# EAGLE design rogger (EAGLE 7.2.0)
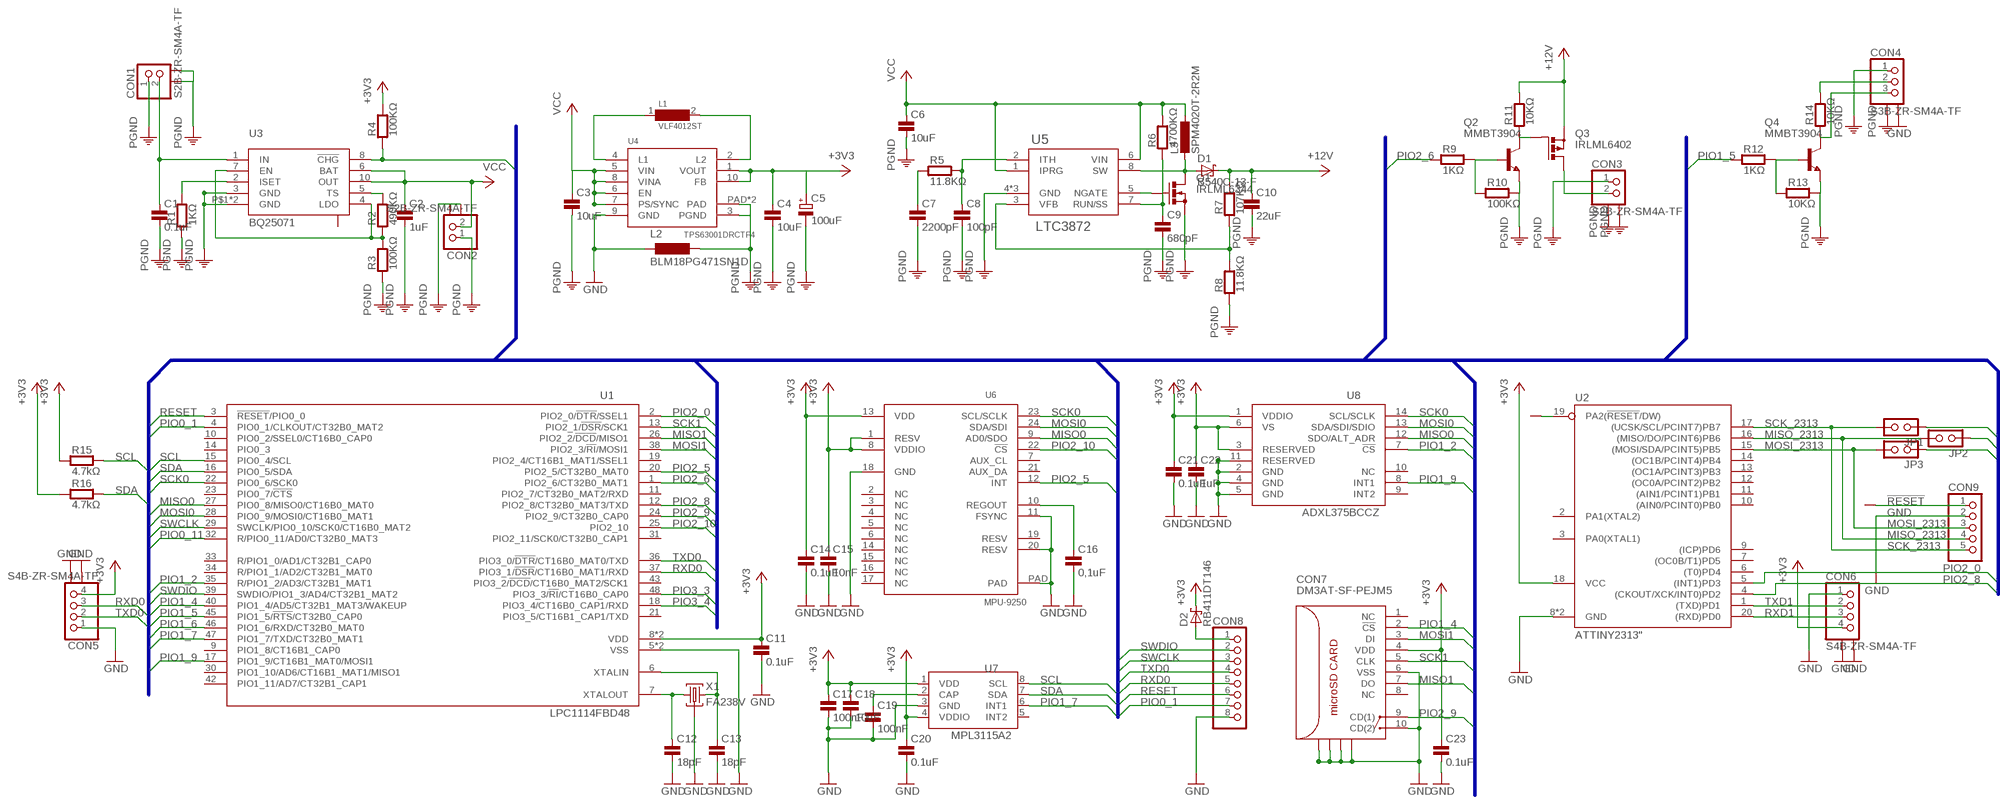
[diagram p0: schematic, sheet 1, part 1 of 2]
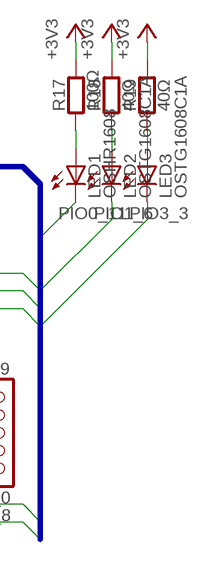
[diagram p1: schematic, sheet 1, part 2 of 2]

## Parts
C1  0.1uF  C0603  [0603]
C2  1uF  C0603  [0603]
C3  10uF  C0603  [0603]
C4  10uF  C0603  [0603]
C5  100uF  CPOL-EU153CLV-0505  [153CLV-0505]
C6  10uF  C0603  [0603]
C7  2200pF  C0603  [0603]
C8  100pF  C0603  [0603]
C9  680pF  C0603  [0603]
C10  22uF  C0805  [0805]
C11  0.1uF  C0603  [0603]
C12  18pF  C0603  [0603]
C13  18pF  C0603  [0603]
C14  0.1uF  C0603  [0603]
C15  10nF  C0603  [0603]
C16  0,1uF  C0603  [0603]
C17  100nF  C0603  [0603]
C18  10uF  C0603  [0603]
C19  100nF  C0603  [0603]
C20  0.1uF  C0603  [0603]
C21  0.1uF  C0603  [0603]
C22  1uF  C0603  [0603]
C23  0.1uF  C0603  [0603]
CON1  S2B-ZR-SM4A-TF  [S2B-ZR-SM4A-TF]
CON2  S2B-ZR-SM4A-TF  [S2B-ZR-SM4A-TF]
CON3  S2B-ZR-SM4A-TF  [S2B-ZR-SM4A-TF]
CON4  S3B-ZR-SM4A-TF  [S3B-ZR-SM4A-TF]
CON5  S4B-ZR-SM4A-TF  [S4B-ZR-SM4A-TF]
CON6  S4B-ZR-SM4A-TF  [S4B-ZR-SM4A-TF]
CON7  DM3AT-SF-PEJM5  [DM3AT-SF-PEJM5]
CON8  PINHEAD1X8  [1X8]
CON9  PINHEAD1X5  [1X5]
D1  B540C-13-F  B540C  [SMC]
D2  RB411DT146  BAS40  [SOT23]
JP1  JUMP-2  [JUMP-2]
JP2  JUMP-2  [JUMP-2]
JP3  JUMP-2  [JUMP-2]
L1  VLF4012ST  [VLF4012ST]
L2  BLM18PG471SN1D  L  [0603]
L3  SPM4020T-2R2M  [SPM4020T-2R2M]
LED1  OSHR1608  LEDCHIP-LED0603  [CHIP-LED0603]
LED2  OSTG1608C1A  LEDCHIP-LED0603  [CHIP-LED0603]
LED3  OSTG1608C1A  LEDCHIP-LED0603  [CHIP-LED0603]
Q1  IRLML6344  NMOS  [SOT23]
Q2  MMBT3904  NPN  [SOT23]
Q3  IRLML6402  PMOSSOT23  [SOT23]
Q4  MMBT3904  NPN  [SOT23]
R1  1KΩ  R0603  [0603]
R2  490KΩ  R0603  [0603]
R3  100KΩ  R0603  [0603]
R4  100KΩ  R0603  [0603]
R5  11.8KΩ  R0603  [0603]
R6  4700KΩ  R0603  [0603]
R7  107KΩ  R0603  [0603]
R8  11.8KΩ  R0603  [0603]
R9  1KΩ  R0603  [0603]
R10  100KΩ  R0603  [0603]
R11  10KΩ  R0603  [0603]
R12  1KΩ  R0603  [0603]
R13  10KΩ  R0603  [0603]
R14  10KΩ  R0603  [0603]
R15  4.7kΩ  R0603  [0603]
R16  4.7kΩ  R0603  [0603]
R17  100Ω  R0603  [0603]
R18  40Ω  R0603  [0603]
R19  40Ω  R0603  [0603]
U1  LPC1114FBD48  [LQFP48]
U2  ATTINY2313"  [MLF20]
U3  BQ25071  [W-PWSON-N10]
U4  TPS63001DRCTF4  [S-PVSON-N10]
U5  LTC3872  [TSOT-23-8]
U6  MPU-9250  [24QFN]
U7  MPL3115A2  [MPL3115A2]
U8  ADXL375BCCZ  [LGA-14]
X1  FA238V  [V66RA]

## Nets
!RESET!: CON9.1 U2.19(PA2(!RESET!/DW)) ; supply symbol labelled CONNECT
+3V3: C4.1 C5.+ C11.1 C14.1 C15.1 C17.1 C18.1 C20.1 C21.1 C22.1 C23.1 CON5.4 CON6.4 CON7.4(VDD) D2.3(C) R4.2 R15.1 R16.1 R17.2 R18.2 R19.2 U1.8(VDD) U1.44(VDD) U2.18(VCC) U4.1(VOUT) U4.10(FB) U6.1(RESV) U6.8(VDDIO) U6.13(VDD) U7.1(VDD) U7.4(VDDIO) U8.1(VDDIO) U8.3(RESERVED) U8.6(VS)
+5V: CON4.2 R14.2
+12V: C10.1 D1.C Q3.2(S) R7.2 R11.2
GND: C11.2 C12.2 C13.2 C14.2 C15.2 C16.2 C17.2 C18.2 C19.2 C20.2 C21.2 C22.2 C23.2 CON4.PAD2 CON5.1 CON5.PAD1 CON5.PAD2 CON6.1 CON6.PAD1 CON6.PAD2 CON7.6(VSS) CON7.10(CD(2)) CON7.P$10 CON7.P$11 CON7.P$12 CON7.P$14 CON8.8 CON9.2 L2.1 U1.5(VSS) U1.41(VSS) U2.8(GND) U2.P$1(GND) U4.9(GND) U6.11(FSYNC) U6.18(GND) U6.20(RESV) U6.PAD U7.3(GND) U8.2(GND) U8.4(GND) U8.5(GND) U8.11(RESERVED) X1.P2GND(GND) X1.P4GND(GND)
MISO0: JP2.2 U1.27(PIO0_8/MISO0/CT16B0_MAT0) U6.9(AD0/SDO) U8.12(SDO/ALT_ADR)
MISO1: CON7.7(DO) U1.26(PIO2_2/!DCD!/MISO1)
MISO_2313: CON9.4 JP2.1 U2.16((MISO/DO/PCINT6)PB6)
MOSI0: JP3.2 U1.28(PIO0_9/MOSI0/CT16B0_MAT1) U6.24(SDA/SDI) U8.13(SDA/SDI/SDIO)
MOSI1: CON7.3(DI) U1.38(PIO2_3/!RI!/MOSI1)
MOSI_2313: CON9.3 JP3.1 U2.15((MOSI/SDA/PCINT5)PB5)
N$1: C12.1 U1.7(XTALOUT) X1.P1X1(X1)
N$2: C13.1 U1.6(XTALIN) X1.P3X2(X2)
N$3: CON8.1 D2.1(A)
N$4: L1.1 U4.4(L1)
N$5: L1.2 U4.2(L2)
N$6: C19.1 U7.2(CAP)
N$7: Q1.1(G) U5.5(NGATE)
N$8: D1.A L3.P$2 Q1.3(D) U5.8(SW)
N$9: C16.1 U6.10(REGOUT)
N$11: C9.1 R6.1 U5.7(RUN/SS)
N$12: R1.2 U3.2(ISET)
N$13: R7.1 R8.2 U5.3(VFB)
N$14: R2.2 U3.5(TS)
N$15: R2.1 R3.2 U3.4(LDO) U3.7(EN)
N$16: C8.1 R5.2 U5.2(ITH)
N$17: CON3.2 Q3.3(D)
N$18: C7.1 R5.1
N$19: Q2.3(C) Q3.1(G) R11.1
N$21: CON4.3 Q4.3(C) R14.1
N$22: Q2.1(B) R9.2 R10.1
N$24: Q4.1(B) R12.2 R13.1
N$26: LED1.A R17.1
N$29: C1.1 CON1.2 U3.1(IN)
N$36: LED2.A R18.1
N$37: LED3.A R19.1
PE: C1.2 C2.2 C3.2 C4.2 C5.- C6.2 C7.2 C8.2 C9.2 C10.2 CON1.1 CON1.PAD1 CON1.PAD2 CON2.1 CON2.PAD1 CON2.PAD2 CON3.1 CON3.PAD1 CON3.PAD2 CON4.1 CON4.PAD1 L2.2 Q1.2(S) Q2.2(E) Q4.2(E) R1.1 R3.1 R8.1 R10.2 R13.2 U3.3(GND) U3.P$1(GND) U3.PAD(GND) U4.3(PGND) U4.PAD U4.PAD@1(PAD) U5.4(GND) U5.P$1(GND) U5.P$2(GND) ; supply symbol labelled PGND
PIO0_1: CON8.7 U1.4(PIO0_1/CLKOUT/CT32B0_MAT2)
PIO0_11: LED1.C U1.32(R/PIO0_11/AD0/CT32B0_MAT3)
PIO1_2: U1.35(R/PIO1_2/AD3/CT32B1_MAT1) U8.7(!CS!)
PIO1_4: CON7.2(!CS!) U1.40(PIO1_4/AD5/CT32B1_MAT3/WAKEUP)
PIO1_5: R12.1 U1.45(PIO1_5/!RTS!/CT32B0_CAP0)
PIO1_6: LED2.C U1.46(PIO1_6/RXD/CT32B0_MAT0)
PIO1_7: U1.47(PIO1_7/TXD/CT32B0_MAT1) U7.6(INT1)
PIO1_9: U1.17(PIO1_9/CT16B1_MAT0/MOSI1) U8.8(INT1)
PIO2_0: U1.2(PIO2_0/!DTR!/SSEL1) U2.5((INT1)PD3)
PIO2_5: U1.20(PIO2_5/CT32B0_MAT0) U6.12(INT)
PIO2_6: R9.1 U1.1(PIO2_6/CT32B0_MAT1)
PIO2_8: U1.12(PIO2_8/CT32B0_MAT3/TXD) U2.4((CKOUT/XCK/INT0)PD2)
PIO2_9: CON7.9(CD(1)) U1.24(PIO2_9/CT32B0_CAP0)
PIO2_10: U1.25(PIO2_10) U6.22(!CS!)
PIO3_3: LED3.C U1.48(PIO3_3/!RI!/CT16B0_CAP0)
PIO3_4: R4.1 U1.18(PIO3_4/CT16B0_CAP1/RXD) U3.8(!CHG!)
RESET: CON8.6 U1.3(!RESET!/PIO0_0)
RXD0: CON5.3 CON8.5 U1.37(PIO3_1/!DSR!/CT16B0_MAT1/RXD)
RXD1: CON6.3 U2.20((RXD)PD0)
SCK0: JP1.2 U1.22(PIO0_6/SCK0) U6.23(SCL/SCLK) U8.14(SCL/SCLK)
SCK1: CON7.5(CLK) U1.13(PIO2_1/!DSR!/SCK1)
SCK_2313: CON9.5 JP1.1 U2.17((UCSK/SCL/PCINT7)PB7)
SCL: R15.2 U1.15(PIO0_4/SCL) U7.8(SCL)
SDA: R16.2 U1.16(PIO0_5/SDA) U7.7(SDA)
SWCLK: CON8.3 U1.29(SWCLK/PIO0_10/SCK0/CT16B0_MAT2)
SWDIO: CON8.2 U1.39(SWDIO/PIO1_3/AD4/CT32B1_MAT2)
TXD0: CON5.2 CON8.4 U1.36(PIO3_0/!DTR!/CT16B0_MAT0/TXD)
TXD1: CON6.2 U2.1((TXD)PD1)
VCC: C2.1 C3.1 C6.1 CON2.2 L3.P$1 R6.2 U3.6(BAT) U3.10(OUT) U4.5(VIN) U4.6(EN) U4.7(PS/SYNC) U4.8(VINA) U5.1(IPRG) U5.6(VIN)
Unconnected: CON7.1(NC) CON7.8(NC) U1.9(PIO1_8/CT16B1_CAP0) U1.10(PIO0_2/SSEL0/CT16B0_CAP0) U1.11(PIO2_7/CT32B0_MAT2/RXD) U1.14(PIO0_3) U1.19(PIO2_4/CT16B1_MAT1/SSEL1) U1.21(PIO3_5/CT16B1_CAP1/TXD) U1.23(PIO0_7/!CTS!) U1.30(PIO1_10/AD6/CT16B1_MAT1/MISO1) U1.31(PIO2_11/SCK0/CT32B0_CAP1) U1.33(R/PIO1_0/AD1/CT32B1_CAP0) U1.34(R/PIO1_1/AD2/CT32B1_MAT0) U1.42(PIO1_11/AD7/CT32B1_CAP1) U1.43(PIO3_2/!DCD!/CT16B0_MAT2/SCK1) U2.2(PA1(XTAL2)) U2.3(PA0(XTAL1)) U2.6((T0)PD4) U2.7((OC0B/T1)PD5) U2.9((ICP)PD6) U2.10((AIN0/PCINT0)PB0) U2.11((AIN1/PCINT1)PB1) U2.12((OC0A/PCINT2)PB2) U2.13((OC1A/PCINT3)PB3) U2.14((OC1B/PCINT4)PB4) U6.2(NC) U6.3(NC) U6.4(NC) U6.5(NC) U6.6(NC) U6.7(AUX_CL) U6.14(NC) U6.15(NC) U6.16(NC) U6.17(NC) U6.19(RESV) U6.21(AUX_DA) U7.5(INT2) U8.9(INT2) U8.10(NC)

## Buses
PIO0_[0..11],PIO1_[0..11],PIO2_[0..11],PIO3_[0..5],SCL,SDA,SCK[0..1],MISO[0..1],MOSI[0..1],RESET,SWCLK,SWDIO,TXD0,RXD0

## Power pins joined to a net without a drawn wire
PAD: U3.9(PAD)

## Library data of the parts
C1-C4 C6-C23 = 201508-noshiro:C
C5 = rcl:CPOL-EU: POLARIZED CAPACITOR, European symbol
CON1-CON3 = 201508-noshiro:S2B-ZR-SM4A-TF
CON4 = 201508-noshiro:S3B-ZR-SM4A-TF
CON5 CON6 = 201508-noshiro:S4B-ZR-SM4A-TF
CON7 = 201508-noshiro:DM3AT-SF-PEJM5
CON8 = 201508-noshiro:PINHEAD1X8: PIN HEADER
CON9 = 201508-noshiro:PINHEAD1X5: PIN HEADER
D1 = 201508-noshiro:B540C
D2 = 201508-noshiro:BAS40: Silicon Schottky Diodes General-purpose diode for high-speed switching
JP1-JP3 = 201508-noshiro:JUMP-2
L1 = 201508-noshiro:VLF4012ST
L2 = 201508-noshiro:L
L3 = 201508-noshiro:SPM4020T-2R2M
LED1-LED3 = led:LED: LED OSRAM: - CHIPLED LG R971, LG N971, LY N971, LG Q971, LY Q971, LO R971, LY R971 LH N974, LH R974 LS Q976, LO Q976, LY Q976 LO Q996 - Hyper CHIPLED LW Q18S LB Q993, LB Q99A, LB R99A - SideLED LS A670, LO A670, LY A670, LG A670, LP A670 LB A673, LV A673, LT A673, LW A673 LH A674 LY A675 LS A676, LA A676, LO A676, LY A676, LW A676 LS A679, LY A679, LG A679 - Hyper Micro SIDELED® LS Y876, LA Y876, LO Y876, LY Y876 LT Y87S - SmartLED LW L88C, LW L88S LB L89C, LB L89S, LG L890 LS L89K, LO L89K, LY L89K LS L896, LA L896, LO L896, LY L896 - TOPLED LS T670, LO T670, LY T670, LG T670, LP T670 LSG T670, LSP T670, LSY T670, LOP T670, LYG T670 LG T671, LOG T671, LSG T671 LB T673, LV T673, LT T673, LW T673 LH T674 LS T676, LA T676, LO T676, LY T676, LB T676, LH T676, LSB T676, LW T676 LB T67C, LV T67C, LT T67C, LS T67K, LO T67K, LY T67K, LW E67C LS E67B, LA E67B, LO E67B, LY E67B, LB E67C, LV E67C, LT E67C LW T67C LS T679, LY T679, LG T679 LS T770, LO T770, LY T770, LG T770, LP T770 LB T773, LV T773, LT T773, LW T773 LH T774 LS E675, LA E675, LY E675, LS T675 LS T776, LA T776, LO T776, LY T776, LB T776 LHGB T686 LT T68C, LB T68C - Hyper Mini TOPLED® LB M676 - Mini TOPLED Santana® LG M470 LS M47K, LO M47K, LY M47K Source: http://www.osram.convergy.de LUXEON: - LUMILED® LXK2-PW12-R00, LXK2-PW12-S00, LXK2-PW14-U00, LXK2-PW14-V00 LXK2-PM12-R00, LXK2-PM12-S00, LXK2-PM14-U00 LXK2-PE12-Q00, LXK2-PE12-R00, LXK2-PE12-S00, LXK2-PE14-T00, LXK2-PE14-U00 LXK2-PB12-K00, LXK2-PB12-L00, LXK2-PB12-M00, LXK2-PB14-N00, LXK2-PB14-P00, LXK2-PB14-Q00 LXK2-PR12-L00, LXK2-PR12-M00, LXK2-PR14-Q00, LXK2-PR14-R00 LXK2-PD12-Q00, LXK2-PD12-R00, LXK2-PD12-S00 LXK2-PH12-R00, LXK2-PH12-S00 LXK2-PL12-P00, LXK2-PL12-Q00, LXK2-PL12-R00 Source: www.luxeon.com KINGBRIGHT: KA-3528ASYC Source: www.kingbright.com
Q1 = 201508-noshiro:NMOS: N-CHANNEL MOS FET
Q2 Q4 = 201508-noshiro:NPN: NPN Transistor
Q3 = 201508-noshiro:PMOS: Power MOSFET P-Channel
R1-R19 = 201508-noshiro:R
U1 = 201508-noshiro:LPC1114FBD48
U2 = 201508-noshiro:ATTINY2313: Atmel Tiny2313 2K Flash, 128 bytes EEPROM, 128 bytes RAM
U3 = 201508-noshiro:BQ25071
U4 = 201508-noshiro:TPS63001DRCTF4
U5 = 201508-noshiro:LTC3872
U6 = 201508-noshiro:MPU-9250
U7 = 201508-noshiro:MPL3115A2
U8 = 201508-noshiro:ADXL375BCCZ: The ADXL375 is a small, thin, 3-axis accelerometer that provideslow power consumption and high resolution measurement up to ±200 g. The digital output data is formatted as 16-bit, twos complement data and is accessible through a SPI (3- or 4-wire) or I2C digital interface. An integrated memory management system with a 32-level first in, first out (FIFO) buffer can be used to store data to minimize host processor activity and lower overall system power consumption. Low power modes enable intelligent motion-based power management with threshold sensing and active acceleration measurement at extremely low power dissipation. The ADXL375 is supplied in a small, thin, 3 mm × 5 mm × 1 mm, 14-lead LGA.
X1 = 201508-noshiro:FA238V: EPSON TOYOCOM CRYSTAL V66RA package FA238V

## Board
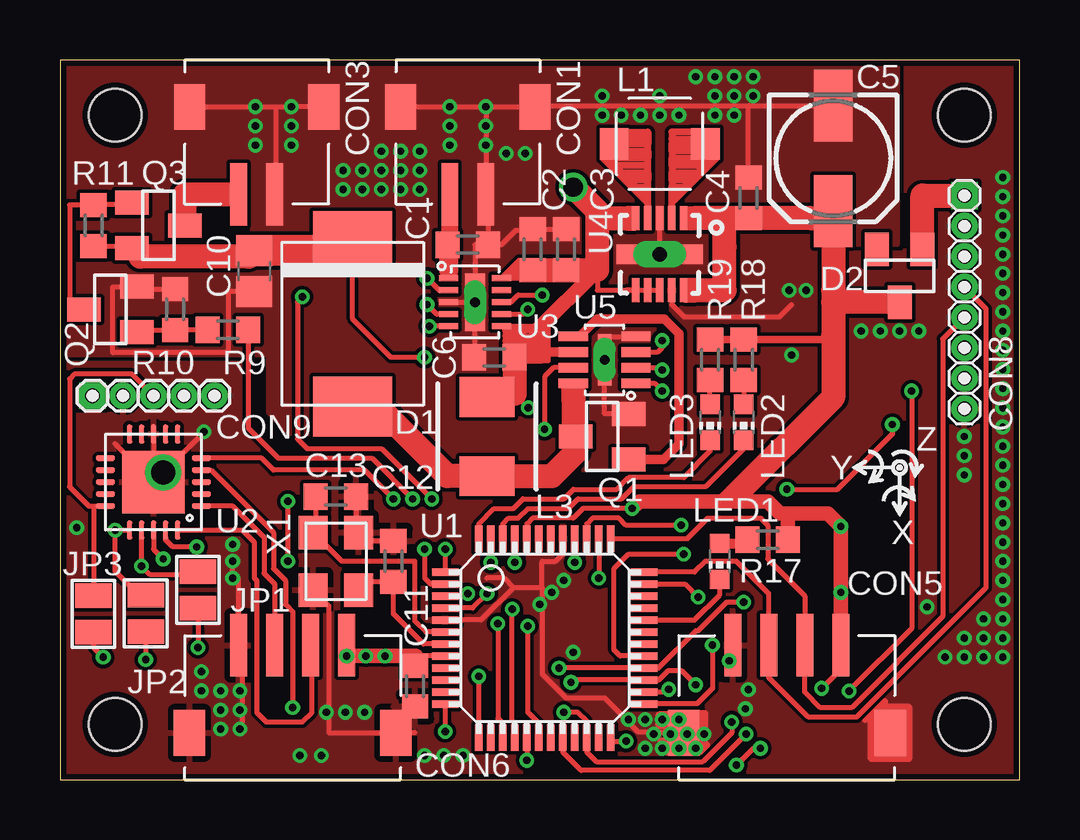
[diagram p2: board, top side]
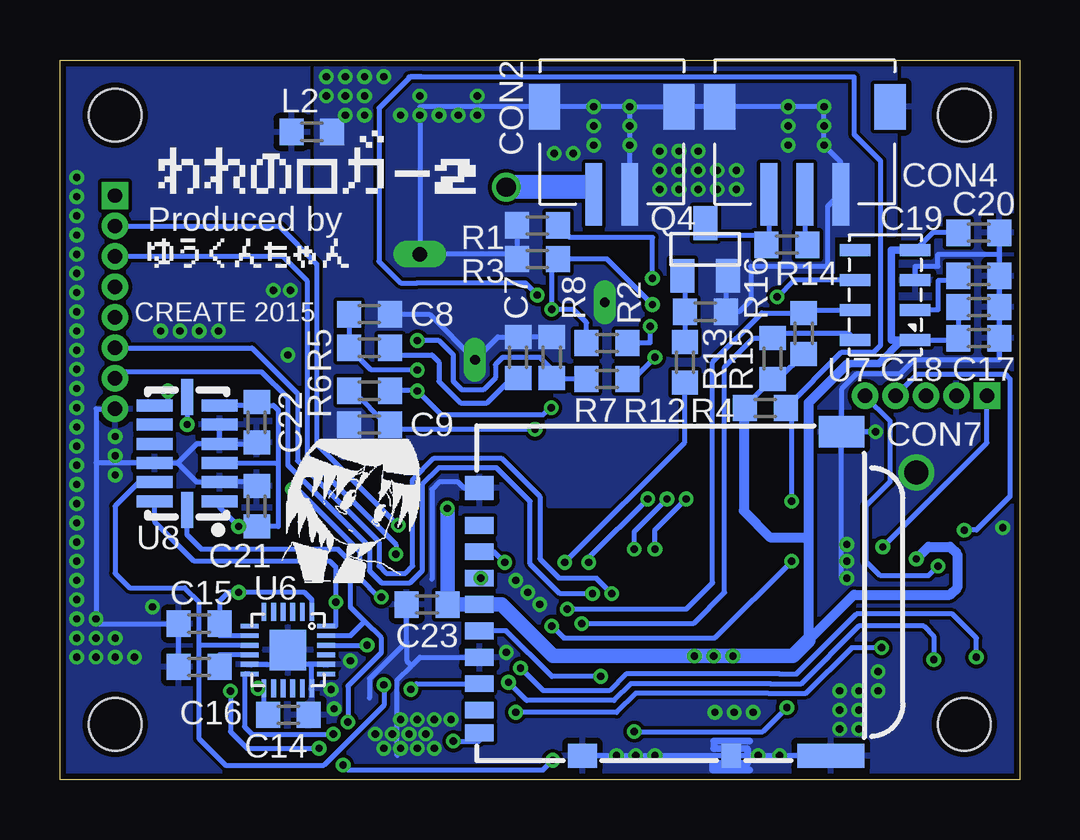
[diagram p3: board, bottom side, seen from below]

Size 40 x 30 mm. Coordinates in mm from the lower left corner, seen from the top.
Outline: 0,0 40,0 40,30 0,30 0,0
Copper layers (1*16): Top 0.035mm / dielectric 1.5mm / Bottom 0.035mm
Design rules "Elecrow_2-layer_eagle_rule": minimum track width 6mil, minimum drill 12mil, track to track 6mil, track to pad 6mil, pad to pad 6mil, via to via 6mil, smd to smd 0mil, copper to edge 10mil, drill to drill 10mil, minimum pad ring 10mil, minimum via ring 6mil, stop-mask expansion 2mil, vias tented up to drill 100mil, thermal gap 10mil
Holes 2.2 mm at 2.3,2.3 2.3,27.7 37.7,2.3 37.7,27.7
tKeepout: area 0,0 to 4.6,4.6; area 0,25.4 to 4.6,30; area 35.4,25.4 to 40,30; area 35.4,0 to 40,4.6
bKeepout: area 0,0 to 4.6,4.6; area 0,25.4 to 4.6,30; area 35.4,25.4 to 40,30; area 35.4,0 to 40,4.6

### Footprints (pad centres in the part's own frame; a part is rotated, then mirrored left to right if it is on the bottom)
0603 = smd 1 x 1.1: 1 -0.85,0; 2 0.85,0
153CLV-0505 = smd 3 x 1.6: + 2.2,0; - -2.2,0
0805 = smd 1.3 x 1.5: 1 -0.85,0; 2 0.85,0
S2B-ZR-SM4A-TF = smd 0.7 x 2.6: 1 0.75,-5.6; 2 -0.75,-5.6 | smd 1.3 x 1.9: PAD1 -2.8,-1.95; PAD2 2.8,-1.95
S3B-ZR-SM4A-TF = smd 0.7 x 2.6: 1 1.5,-5.6; 2 0,-5.6; 3 -1.5,-5.6 | smd 1.3 x 1.9: PAD1 -3.55,-1.95; PAD2 3.55,-1.95
S4B-ZR-SM4A-TF = smd 0.7 x 2.6: 1 2.25,-5.6; 2 0.75,-5.6; 3 -0.75,-5.6; 4 -2.25,-5.6 | smd 1.3 x 1.9: PAD1 -4.3,-1.95; PAD2 4.3,-1.95
DM3AT-SF-PEJM5 = smd 0.7 x 1.2: 1 3.2,7.62; 2 2.1,7.62; 3 1,7.62; 4 -0.1,7.62; 5 -1.2,7.62; 6 -2.3,7.62; 7 -3.4,7.62; 8 -4.5,7.62; 9 -5.45,7.62 | smd 1 x 0.8: 10 -6.4,-2.88 | smd 1 x 1.2: P$10 4.75,7.62; P$12 -6.4,3.32 | smd 1.3 x 1.9: P$11 7.1,-7.48 | smd 1 x 2.8: P$14 -6.4,-7.03
1X8 = drill 0.6 pad 0.813 square: 1 -4.445,0 | drill 0.6 pad 0.813: 2 -3.175,0; 3 -1.905,0; 4 -0.635,0; 5 0.635,0; 6 1.905,0; 7 3.175,0; 8 4.445,0
1X5 = drill 0.6 pad 0.813 square: 1 -2.54,0 | drill 0.6 pad 0.813: 2 -1.27,0; 3 0,0; 4 1.27,0; 5 2.54,0
SMC = smd 2.5 x 3.3: A 3.45,0; C -3.45,0
SOT23 = smd 1 x 1.4: 1 -0.95,-1.1; 2 0.95,-1.1; 3 0,1.1
JUMP-2 = smd 1.016 x 1.524: 1 -0.762,0; 2 0.762,0
VLF4012ST = smd 1.2 x 1.3: 1 1.9,0; 2 -1.9,0
SPM4020T-2R2M = smd 2.3 x 1.65: P$1 0,-1.65; P$2 0,1.65
CHIP-LED0603 = smd 0.8 x 0.8: A 0,-0.75; C 0,0.75
LQFP48 = smd 0.32 x 1.1: 1 -2.75,-4.15; 2 -2.25,-4.15; 3 -1.75,-4.15; 4 -1.25,-4.15; 5 -0.75,-4.15; 6 -0.25,-4.15; 7 0.25,-4.15; 8 0.75,-4.15; 9 1.25,-4.15; 10 1.75,-4.15; 11 2.25,-4.15; 12 2.75,-4.15; 25 2.75,4.15; 26 2.25,4.15; 27 1.75,4.15; 28 1.25,4.15; 29 0.75,4.15; 30 0.25,4.15; 31 -0.25,4.15; 32 -0.75,4.15; 33 -1.25,4.15; 34 -1.75,4.15; 35 -2.25,4.15; 36 -2.75,4.15 | smd 1.1 x 0.32: 13 4.15,-2.75; 14 4.15,-2.25; 15 4.15,-1.75; 16 4.15,-1.25; 17 4.15,-0.75; 18 4.15,-0.25; 19 4.15,0.25; 20 4.15,0.75; 21 4.15,1.25; 22 4.15,1.75; 23 4.15,2.25; 24 4.15,2.75; 37 -4.15,2.75; 38 -4.15,2.25; 39 -4.15,1.75; 40 -4.15,1.25; 41 -4.15,0.75; 42 -4.15,0.25; 43 -4.15,-0.25; 44 -4.15,-0.75; 45 -4.15,-1.25; 46 -4.15,-1.75; 47 -4.15,-2.25; 48 -4.15,-2.75
MLF20 = smd 0.8 x 0.23: 1 -2,1; 2 -2,0.5; 3 -2,0; 4 -2,-0.5; 5 -2,-1; 11 2,-1; 12 2,-0.5; 13 2,0; 14 2,0.5; 15 2,1 | smd 0.23 x 0.8: 6 -1,-2; 7 -0.5,-2; 8 0,-2; 9 0.5,-2; 10 1,-2; 16 1,2; 17 0.5,2; 18 0,2; 19 -0.5,2; 20 -1,2 | smd 2.6 x 2.6: P$1 0,0
W-PWSON-N10 = smd 0.25 x 0.8: 1 -1,-1.1; 2 -0.5,-1.1; 3 0,-1.1; 4 0.5,-1.1; 5 1,-1.1; 6 1,1.1; 7 0.5,1.1; 8 0,1.1; 9 -0.5,1.1; 10 -1,1.1 | drill 0.4 long: P$1 0,0 | smd 2.4 x 0.84: PAD 0,0
S-PVSON-N10 = smd 0.3 x 1: 1 -1,-1.5; 2 -0.5,-1.5; 3 0,-1.5; 4 0.5,-1.5; 5 1,-1.5; 6 1,1.5; 7 0.5,1.5; 8 0,1.5; 9 -0.5,1.5; 10 -1,1.5 | smd 3.6 x 0.8: PAD 0,0 | drill 0.6 long: PAD@1 0,0
TSOT-23-8 = smd 0.4 x 1.22: 1 -0.975,-1.31; 2 -0.325,-1.31; 3 0.325,-1.31; 4 0.975,-1.31; 5 0.975,1.31; 6 0.325,1.31; 7 -0.325,1.31; 8 -0.975,1.31 | drill 0.4 pad 0.56 long: P$1 0,0 | smd 2.15 x 0.56: P$2 0,0
24QFN = smd 0.75 x 0.2: 1 -1.6,1; 2 -1.6,0.6; 3 -1.6,0.2; 4 -1.6,-0.2; 5 -1.6,-0.6; 6 -1.6,-1; 13 1.6,-1; 14 1.6,-0.6; 15 1.6,-0.2; 16 1.6,0.2; 17 1.6,0.6; 18 1.6,1 | smd 0.2 x 0.75: 7 -1,-1.6; 8 -0.6,-1.6; 9 -0.2,-1.6; 10 0.2,-1.6; 11 0.6,-1.6; 12 1,-1.6; 19 1,1.6; 20 0.6,1.6; 21 0.2,1.6; 22 -0.2,1.6; 23 -0.6,1.6; 24 -1,1.6 | smd 1.7 x 1.54: PAD 0,0
MPL3115A2 = smd 1.27 x 0.5: 1 -1.25,1.875; 2 -1.25,0.625; 3 -1.25,-0.625; 4 -1.25,-1.875; 5 1.25,-1.875; 6 1.25,-0.625; 7 1.25,0.625; 8 1.25,1.875
LGA-14 = smd 0.5 x 1.5: 1 -2,-1.35; 2 -1.2,-1.35; 3 -0.4,-1.35; 4 0.4,-1.35; 5 1.2,-1.35; 6 2,-1.35; 8 2,1.35; 9 1.2,1.35; 10 0.4,1.35; 11 -0.4,1.35; 12 -1.2,1.35; 13 -2,1.35 | smd 1.5 x 0.5: 7 2.35,0; 14 -2.35,0
V66RA = smd 1.4 x 1.2: P1X1 -1.2,-0.95; P2GND 1.2,-0.95; P3X2 1.2,0.95; P4GND -1.2,0.95

### Placement (x,y rotation side)
C1  17,22.3 0 top
C2  19.7,22.1 90 top
C3  21.1,22.1 90 top
C4  28.7,24.25 90 top
C5  32.23,25.9 270 top
C6  18.1,17.6 180 top
C7  20.9,17.6 90 bottom
C8  27.1,19.4 0 bottom
C9  27.1,14.8 180 bottom
C10  47uF  [0805]  8.1,21.2 270 top
C11  14.8,3.9 270 top
C12  13.9,9.1 90 top
C13  11.5,11.8 0 top
C14  30.48,2.7 0 bottom
C15  34.2,6.5 180 bottom
C16  34.2,4.7 180 bottom
C17  1.7,18.4 0 bottom
C18  1.7,19.7 0 bottom
C19  1.7,21 0 bottom
C20  1.7,22.8 0 bottom
C21  31.8,11.4 90 bottom
C22  31.8,14.9 270 bottom
C23  24.7,7.3 180 bottom
CON1  17,30 0 top
CON2  17,30 0 bottom
CON3  8.2,30 0 top
CON4  8.95,30 0 bottom
CON5  30.3,0 180 top
CON6  9.7,0 180 top
CON7  14.9,7.4 90 bottom
CON8  37.7,19.9 270 top
CON9  3.9,16 0 top
D1  B540C  [SMC]  12.2,19 270 top
D2  BAS40  [SOT23]  35,21 180 top
JP1  5.75,7.9 270 top
JP2  3.58,6.92 270 top
JP3  1.4,6.9 270 top
L1  25,26.5 180 top
L2  L  [0603]  29.5,27 0 bottom
L3  17.8,14.3 180 top
LED1  27.5,9.1 180 top
LED2  28.5,14.9 180 top
LED3  27.1,14.9 180 top
Q1  NMOS  [SOT23]  22.6,14.3 90 top
Q2  NPN  [SOT23]  2.1,19.6 90 top
Q3  4.1,23.1 270 top
Q4  NPN  [SOT23]  13.1,22.1 0 bottom
R1  20.1,23.1 0 bottom
R2  17.2,18.2 0 bottom
R3  20.1,21.7 0 bottom
R4  10.6,15.49 180 bottom
R5  27.1,18 180 bottom
R6  27.1,16.21 0 bottom
R7  17.2,16.7 0 bottom
R8  19.5,17.6 270 bottom
R9  10KΩ  [0603]  7,18.75 180 top
R10  10KΩ  [0603]  4.8,19.6 90 top
R11  1.4,23.1 270 top
R12  10KΩ  [0603]  13.95,17.4 90 bottom
R13  13.1,19.5 0 bottom
R14  9.7,22.3 0 bottom
R15  10.3,17.55 90 bottom
R16  9,18.6 90 bottom
R17  29.5,10 0 top
R18  28.5,17.5 90 top
R19  27.1,17.5 90 top
U1  20.21,5.9 270 top
U2  3.9,12.4 180 top
U3  17.3,19.9 270 top
U4  25,21.9 180 top
U5  22.7,17.5 90 top
U6  30.5,5.4 270 bottom
U7  5.6,20.2 180 bottom
U8  34.7,13.6 90 bottom
U$1  [DIRECTION]  35,13 0 top
X1  11.5,9.1 90 top

### Tracks (layer width: path | path; a pad name or v marks a point on that pad's centre or on a via)
!RESET!  (via drill 0.3)
  Top 0.203: v5.7,9.7 4.7,9.7 4.4,10 U2.19
  Bottom 0.203: v5.7,9.7 1.36,14.04 CON9.1
+3V3  (via drill 0.3)
  Top 0.2: 26,23 26.4,23 26.4,23.4 26.4,23.8 26,23.8 U4.1 | 31.33,23.4 32.23,23.4 C5.+ | 26.5,20.8 26,20.8 U4.10 26,20 26.5,20
  Top 0.203: 26.4,20.4 U4.10 28,20.4 | 26.4,23.4 U4.1 | 27.7,22.13 27.7,22.2 | U2.18 3.9,9.6 v4.3,9.2 | v23.85,11.3 21.8,11.3 21.4,10.9 19.7,10.9 19.46,10.66 U1.44 | 11.95,5.9 CON6.4 v11.95,5.15 | v32.55,7.8 32.55,8.6 | U1.8 14.85,5.15 14.8,5.1 C11.1 | 28.1,11.8 27.9,11.6 | 32.23,19.9 32.23,20.4 | R19.2 R18.2 | 32.08,18.35 32.23,18.5 | CON5.4 32.55,4.6 v31.75,3.8
  Top 0.283: 27.6,11.8 27.8,12 28.1,12 28.1,11.8
  Top 0.305: R19.2 32.08,18.35
  Top 0.61: CON5.4 v32.55,7.8 v32.55,10.55 32,11.1 30.35,11.1 | 14.85,5.15 v13.55,5.15 v12.75,5.15 v11.95,5.15 | 30.35,11.1 30,11.1 29.5,11.6 27.9,11.6 24.15,11.6 v23.85,11.3 | R17.2 30.35,11.1
  Top 1: 26.4,20.4 27.7,20.4 27.7,22.2 27.7,23.4 | 27.7,23.4 26.4,23.4 | 31.33,23.4 C4.1 27.7,23.4 | 28.1,11.8 32.23,15.93 32.23,18.5 32.23,20.4 32.23,23.4 | D2.3 32.23,19.9
  Bottom 0.2: 8.8,10.1 8.8,10
  Bottom 0.203: C18.1 C17.1 2.55,18.32 U7.1 4.9,18.32 | C20.1 3.62,22.8 U7.4 | CON7.4 23.4,7.3 | C22.1 31.8,15.6 | 31.8,15.6 U8.6 | 7.15,17.35 7.2,17.3 | 31.8,15.6 31.1,15.6 30.9,15.4 30.9,13.2 | 30.9,13.2 30.9,10.55 C21.1 v32.55,10.55 33.35,11.35 U8.1 | U8.3 30.9,13.2 | U6.1 29.5,7.5 29.8,7.8 v32.55,7.8 33,7.8 33.35,7.45 C15.1 33.35,6 U6.8 | C14.1 31.5,2.7 U6.13 v31.75,3.8 | R16.1 10.05,16.7 R15.1 11.45,15.55 R4.2 11.5,15.49
  Bottom 0.305: 7.15,17.35 5.88,17.35 4.9,18.32 5.35,18.32 5.35,22.07 U7.4
  Bottom 0.406: v4.3,9.2 3.8,9.7 2.9,9.7 2.6,9.4 2.6,8 2.9,7.7 6.9,7.7 8.8,5.8 8.8,10 8.8,15.7 7.2,17.3 | 11.5,15.49 11.5,11.2 10.4,10.1 8.8,10.1
  Bottom 0.61: v23.85,11.3 C23.1 23.4,7.3 21.6,7.3 19.45,5.15 v13.55,5.15 v12.75,5.15 v11.95,5.15 9.45,5.15 8.8,5.8
+5V
  Bottom 0.203: CON4.2 8.95,22.4 R14.2
+12V  (via drill 0.3)
  Top 0.203: v15.2,17.6 13.8,17.6 12.2,19.2 D1.C 11.8,22.05 | C10.1 7.85,21.8 | 3.35,21.8 Q3.2 | Q3.2 2.95,22.15 2.8,22.3 | R11.2 2.9,22.25 Q3.2
  Top 1: 7.85,21.8 3.35,21.8
  Top 1.3: 11.8,22.05 C10.1
  Bottom 0.203: R7.2 16.1,16.7 v15.2,17.6
GND  (via drill 0.3, 1)
  Top 0.2: U2.P$1 v4.3,12.8 v6,14.5 | 14.8,1.95 CON6.PAD1 | 26.65,2.8 26.9,2.8 26.9,2.6 | 26.9,2.6 26.65,2.6 26.65,2.4 26.9,2.4 26.9,2.2 26.65,2.2 26.65,1.55 26.8,1.7 26.9,1.7 26.9,1.6 26.65,1.35 26.65,1.1 27,1.45 | 26.9,2.6 26.9,1.95 CON5.PAD2 | 33.55,2.45 34.4,3.3 34.4,3.1 34.48,3.02 34.48,2.08 CON5.PAD1
  Top 0.203: U2.P$1 U2.8 3.9,14.73 | C13.2 12.35,10.4 X1.P2GND 12.8,9.95 C12.2 13.9,10.3 | X1.P4GND 11.2,7.25 11.2,1.95 CON6.PAD1 | U4.9 25.5,19.8 26,19.3 30,19.3 30.5,19.8 | 20.1,8 20.1,4.4 21.1,3.4 22.7,3.4 24.1,2 25.95,2 CON5.PAD2 | U1.5 17.55,6.65 18.9,8 | 7.6,1.95 7.6,4.3 7.45,4.45 CON6.1 7.42,5.6 7.42,8.4 v7.2,8.4 v7.2,9.1 | 34.6,1.9 CON5.PAD1 | 20.1,8 18.9,8 | 20.1,8 20.1,9.1 20.65,9.1 20.96,9.41 U1.41 | 18.9,8 18.5,8.4 17.8,8.4 | 34.6,1.85 CON5.PAD1 | 2.3,14 2.8,13.5 | 34.6,2.1 CON5.PAD1
  Top 0.3: 34.23,3.02 34.48,3.02 35.38,3.02 35.38,0.88 33.83,0.88 33.83,2.62
  Top 0.4: 25,2.65 25.35,2.65 25.35,2.3 | 25.35,2.3 25,2.3 | 25.05,1.2 25.35,1.2 25.35,1.55 | 25.35,1.55 25.1,1.55 | 25.35,1.55 25.35,1.95 | 25.35,2.3 25.35,1.95 | 25.35,1.95 CON5.PAD2 | v26.15,1.9 26.15,2 26,2 | 26.8,1.9 v26.85,1.9 26.9,1.9 26.9,1.95
  Bottom 0.2: v7.2,8.4 7.42,8.4 CON7.P$11 v6,14.5 | 0.85,17.5 1.9,17.5
  Bottom 0.203: CON7.P$12 v16.8,1 v16,1 v15.2,1 CON7.10 v10.9,1 v10,1 CON7.P$14 | CON7.6 25,5.1 25.35,4.75 | C19.2 C18.2 C17.2 0.85,17.5 4.4,17.5 5,16.9 6.8,16.9 7.42,16.28 CON7.P$11 7.4,14.52 | U8.4 34.3,14 35.1,13.2 | 35.1,13.2 U8.11 38.5,13.2 | 35.1,13.2 34.3,12.4 U8.2 31.8,12.4 C21.2 | C16.2 C15.2 38.5,6.5 38.5,13.2 | 38.5,13.2 38.5,15.46 CON8.8 | U8.4 31.8,14 C22.2 | U8.4 U8.5 | U7.3 4.35,21.4 3.4,21.4 3.4,21.9 0.85,21.9 C19.2 | C20.2 C19.2 | 25.55,5.75 27.1,4.2 27.1,3.4 | 25.55,5.75 C23.2 | CON7.P$10 23.15,12.15 23.4,12.4 24.2,12.4 24.5,12.1 24.5,8.35 | 25.55,5.75 25.55,4.95 25.35,4.75 | 25.94,1 25.94,4.16 25.35,4.75 | U6.20 29.54,4.8 | 29.54,4.8 29.9,4.8 | 29.9,4.8 U6.PAD | U6.11 31.1,4.8 U6.PAD | U6.PAD 30.5,5.2 30.1,4.8 29.9,4.8 | 29.54,4.8 29.54,3.8 U6.18
  Bottom 0.3: 11.25,1.6 12.75,1.6 12.75,1.3 11.35,1.3 11.35,0.65 12.8,0.65 12.8,0.4 11.25,0.4
  other vias: 30.4,20.4 33.4,18.7 34.2,18.7 35,18.7 35.8,18.7 37.7,14.3 37.7,13.5 11.9,2.8 12.7,2.8 5.9,4.5 5.9,3.7 6.7,3.7 7.5,3.7 7.5,2.9 6.7,2.9 7.5,2.1 6.7,2.1 0.7,10.5 21.4,5.3 30.5,17.7 21,8.3 20.5,7.8 20,7.3 36.9,5.1 37.7,5.1 38.5,5.1 39.3,5.1 39.3,5.9 39.3,6.7 39.3,7.5 38.5,6.7 38.5,5.9 37.7,5.9 11.1,2.8 39.3,24.3 39.3,23.5 39.3,22.7 39.3,21.9 39.3,21.1 39.3,20.3 39.3,19.5 28.7,3.75 28.57,2.95 24.4,2.5 25.1,2.5 25.8,2.5 23.7,2.5 24.75,1.9 25.8,1.3 25.45,1.9 24.4,1.3 25.1,1.3 26.5,1.3 27.9,4.95 39.3,9.9 39.3,9.1 39.3,8.3 39.3,10.7 39.3,11.5 39.3,12.3 39.3,13.1 39.3,15.5 39.3,14.7 39.3,13.9 36.15,7.2 37.7,12.7 39.3,18.7 39.3,17.9 39.3,17.1 39.3,16.3 39.3,25.1 7.2,9.8 31.1,20.4
  pour Bottom (rank 2): 0,30 40,30 40,0 0,0
  pour Top (rank 2): 0,30 40,30 40,0 0,0
MISO0  (via drill 0.3)
  Top 0.203: JP2.2 v3.58,5 | v21.3,4.05 21.4,4.15 U1.27 24.96,4.15 25.36,4.55 25.9,4.55 v26.5,3.95
  Bottom 0.2: 10.4,4 9.1,4 6.7,6.4
  Bottom 0.203: 6.7,6.4 4,6.4 3.58,5.97 v3.58,5 | 34.2,5.6 34.2,1.7 33.1,0.6 29,0.6 26.5,3.1 v26.5,3.95 | 34.2,5.6 34.2,7.4 34.8,8 37.1,8 37.7,8.6 37.7,11.4 36.7,12.4 U8.12 | 10.4,4 16.2,4 16.9,3.3 20.55,3.3 v21.3,4.05 | U6.9 34.2,5.6
MISO1  (via drill 0.3)
  Top 0.203: U1.26 25.27,3.65 v25.38,3.76
  Bottom 0.203: CON7.7 25.14,4 v25.38,3.76
MISO_2313  (via drill 0.3)
  Top 0.203: JP2.1 3.3,7.69 2.3,8.69 v2.3,10.4 U2.16
  Bottom 0.203: CON9.4 4.27,16.9 0.6,16.9 0.4,16.7 0.4,11.8 1.8,10.4 v2.3,10.4
MOSI0  (via drill 0.3)
  Top 0.203: JP3.2 1.4,5.5 v1.8,5.1 | v28.5,7.4 27.8,7.4 26.6,6.2 26.5,6.2 24.95,4.65 U1.28 v20.8,4.65
  Bottom 0.2: 10,4.4 9.3,4.4 6.8,6.9
  Bottom 0.203: v1.8,5.1 1.8,5.9 2.8,6.9 6.8,6.9 | 10,4.4 16.4,4.4 17.1,3.7 19.85,3.7 v20.8,4.65 | U8.13 36.05,10.75 34.4,9.1 28.75,9.1 28.5,8.85 v28.5,7.4 28.5,6.4 U6.24
MOSI1  (via drill 0.3)
  Top 0.203: U1.38 v22.46,8.4
  Bottom 0.203: v22.46,8.4 CON7.3
MOSI_2313
  Top 0.203: 1.4,11.4 JP3.1 | CON9.3 3,16.9 0.6,16.9 0.4,16.7 0.4,12.2 1.2,11.4 1.4,11.4 | 1.4,11.4 U2.15
N$1
  Top 0.203: U1.7 15.15,5.65 13.9,6.9 C12.1 12.8,8.25 X1.P1X1
N$2
  Top 0.203: U1.6 15.25,6.15 14.8,6.6 14.8,9.1 11.75,9.1 X1.P3X2 10.65,10.4 C13.1
N$3
  Top 1: D2.1 35.95,24.34 CON8.1
N$4
  Top 0.203: 22.6,25.9 24.4,24.1 24.4,24.2 24.5,24.2
  Top 0.3: U4.4 24.5,24.2 | 24.5,24.2 24.5,24.7 | 24.5,24.7 24.5,25 | 24.5,25.3 24.5,25.6 | 24.5,25.6 24.5,25.9 | 24.5,26.2 24.5,26.5 | 24.5,26.5 L1.1 | 22.8,27 24.5,27 24.5,26.7 | 24.5,26.7 22.8,26.7 22.8,26.2 24.5,26.2 | 24.5,26.2 24.5,25.9 | 24.5,25.9 22.8,25.9 23.1,25.6 | 23.4,25.3 23.7,25 | 24,24.7 24.5,24.2 | 24.5,25.6 23.1,25.6 | 23.1,25.6 23.4,25.3 | 23.4,25.3 24.5,25.3 | 24.5,25.3 24.5,25 | 24.5,25 23.7,25 | 23.7,25 24,24.7 | 24,24.7 24.5,24.7 | 24.5,26.7 24.5,26.5
N$5
  Top 0.203: 27.4,25.9 25.6,24.1 25.6,24.2 25.5,24.2
  Top 0.3: U4.2 25.5,24.2 | 25.5,24.2 25.5,24.7 | 25.5,25 25.5,25.3 | 25.5,25.6 25.5,25.9 | 25.5,26.2 25.5,26.5 | 25.5,26.5 L1.2 | 25.5,26.7 25.5,27 27.2,27 27.2,26.7 | 25.5,26.7 25.5,26.5 | 27.2,26.2 27.2,25.9 | 26.9,25.6 26.6,25.3 | 26.3,25 26,24.7 | 26,24.7 25.5,24.2 | 25.5,26.7 27.2,26.7 | 27.2,26.7 27.2,26.2 | 27.2,26.2 25.5,26.2 | 25.5,26.2 25.5,25.9 | 25.5,25.9 27.2,25.9 | 27.2,25.9 26.9,25.6 | 26.9,25.6 25.5,25.6 | 25.5,25.6 25.5,25.3 | 25.5,25.3 26.6,25.3 | 26.6,25.3 26.3,25 | 26.3,25 25.5,25 | 25.5,25 25.5,24.7 | 25.5,24.7 26,24.7
N$6
  Bottom 0.203: C19.1 2.75,20.8 3.4,20.8 3.4,19.57 U7.2
N$7
  Top 0.2: 21.66,18.48 U5.5
  Top 0.4: Q1.1 25.15,13.35 25.8,14 25.8,18.6 25.2,19.2 22.39,19.2 21.66,18.48
N$8
  Top 0.2: 21,15.85 21,16.35 21.8,16.35 21.8,15.85 21.4,15.85 21,15.85
  Top 0.203: U5.8 21.4,15.9 | 21.4,14.41 21.4,14.4 Q1.3 21.35,14.45
  Top 1: 21.4,15.9 21.4,15.85 21.4,14.41 | Q1.3 21.5,13.65 20.5,12.65 L3.P$2 16.15,12.65 13.25,15.55 D1.A
N$9
  Bottom 0.203: U6.10 33.35,5.2 C16.1
N$11  (via drill 0.3)
  Top 0.203: U5.7 20.57,17.18 20.2,16.8 v20.2,14.6
  Bottom 0.203: R6.1 27.64,15.9 27.5,15.9 26.7,15.1 26.55,15.1 C9.1 | 26.1,14.65 C9.1 | v20.2,14.6 26.05,14.6 C9.1
N$12  (via drill 0.3)
  Top 0.203: U3.2 15.8,20.4 v15.3,20.9
  Bottom 0.203: v15.3,20.9 15.3,22.6 18.75,22.6 R1.2
N$13  (via drill 0.3)
  Top 0.2: U5.3 24.93,17.82 25.1,18 v25.1,18.3
  Bottom 0.203: 19.5,16.6 R8.2 | R8.2 19.5,17.1 20,17.6 21.55,17.6 21.85,17.3 21.85,16.75 22.35,16.25 23.25,16.25 23.6,16.6 23.6,17.7 24.2,18.3 v25.1,18.3 | R7.1 19.45,16.7 R8.2
N$14  (via drill 0.3)
  Top 0.203: U3.5 v15.4,18.9
  Bottom 0.203: v15.4,18.9 15.4,18.2 R2.2
N$15  (via drill 0.3)
  Top 0.203: U3.7 19.3,19.4 v19.5,19.6 | U3.4 15.7,19.4 v15.3,19.8
  Bottom 0.203: v15.3,19.8 17.2,21.7 R3.2 19.5,21.45 v19.5,19.6 18.6,19.6 18.05,19.05 R2.1
N$16  (via drill 0.3)
  Top 0.2: U5.2 25,17.18 v25.1,17.07
  Bottom 0.2: v25.1,17.07 26.7,17.07
  Bottom 0.203: 26.7,17.07 27.02,17.07 R5.2 C8.1
N$17
  Top 0.203: 7.3,24.4 CON3.2
  Top 1: Q3.3 5.2,24.4 7.3,24.4
N$18
  Bottom 0.203: R5.1 25.95,17.7 24.5,17.7 24.2,17.4 24.2,16.6 23.3,15.7 22.2,15.7 21.15,16.75 C7.1
N$19
  Top 0.203: Q3.1 2.95,24 1.9,24 1.85,23.95 R11.1 0.4,23.95 0.4,19.6 Q2.3
N$21
  Bottom 0.203: CON4.3 10.45,22.4 R14.1 10.55,22.35 10.9,22.7 12.6,22.7 Q4.3
N$22
  Top 0.203: Q2.1 3.2,18.75 R10.1 R9.2
N$24
  Bottom 0.203: Q4.1 13.95,20.9 R13.1 R12.2
N$26
  Top 0.203: 28.5,9.85 R17.1
  Top 0.406: LED1.A 28.5,9.85
N$29
  Top 0.203: CON1.2 16.15,24.4 | 16.2,22.3 C1.1 16.25,22.4 | 16.2,21.2 U3.1
  Top 0.7: 16.25,22.4 CON1.2
  Top 0.8: 16.2,22.3 16.2,21.2
N$36
  Top 0.203: R18.1 LED2.A
N$37
  Top 0.203: LED3.A R19.1
PE  (via drill 0.3)
  Top 0.2: Q1.2 22.7,15.25 U5.P$2 22.7,18.48 U5.4 | CON2.PAD2 v16.25,28.05 v17.75,28.05 v17.75,27.25 v17.75,26.45 CON1.1 | CON3.PAD1 v8.15,28.05 9,28.05 v9.65,28.05 CON3.PAD2
  Top 0.203: CON1.1 17.85,24.4 C1.2 | C1.2 17.3,22.3 U3.P$1 | C1.2 18.4,22.3 19,22.9 19.65,22.9 C2.2 C3.2 | U4.PAD@1 U4.3 | R10.2 3.2,20.45 Q2.2 2.2,20.55 2.2,17.8 7,17.8 7,20.3 arc-90 7.05,20.35 C10.2 | C6.2 17.3,17.65 U3.P$1 | U3.3 U3.P$1 | CON3.1 9,24.45 9,28.05 | v17.75,28.05 19.3,28.05 | 19.3,28.05 CON2.PAD1 | 19.3,28.05 19.35,28.1 28.7,28.1 | 28.7,28.1 C5.- | C4.2 28.7,28.1
  Bottom 0.203: R8.1 C7.2 21.75,18.45 U5.P$2 24.6,19.4 C8.2 | R1.1 R3.1 arc-90 21.15,21.9 U4.PAD@1 25,28.05 CON2.PAD1 v17.75,28.05 v16.25,28.05 | CON2.1 v16.25,26.45 v16.25,27.25 v16.25,28.05 | v16.25,28.05 CON2.PAD2 CON4.PAD1 v9.65,28.05 v8.15,28.05 v8.15,27.25 v8.15,26.45 7.45,25.75 CON4.1 7.5,24.4 8,23.9 8,21.4 11.2,21.4 11.2,20 11.7,19.5 R13.2 12.25,20.9 Q4.2
  other vias: 9.65,27.25 9.65,26.45 13.4,26.2 13.4,25.4 12.6,25.4 11.8,25.4 11.8,24.6 12.6,24.6 13.4,24.6 18.6,26.1 19.4,26.1 26.5,29.3 27.3,29.3 28.1,29.3 28.9,29.3 14.2,26.2 15,26.2 15,25.4 14.2,25.4 14.2,24.6 15,24.6 22.6,28.5 22.6,27.7 23.4,27.7 24.2,27.7 25,28.5 25,27.7 25.8,27.7 28.1,28.5 28.9,28.5 27.3,28.5 28.1,27.7 27.3,27.7
  pour Top (no thermals): 0,30 34.9,30 34.9,22.3 28.1,22.3 28.1,19.3 25.9,19.3 25.9,13.6 25.2,12.9 21.7,12.9 20.7,11.9 16.3,11.9 13.8,14.4 9.6,14.4 8.7,15.3 8.7,17.7 0,17.7
  pour Bottom (no thermals): 5.2,30 5.2,22.7 7.8,22.7 7.8,19.6 10.6,19.6 13.9,16.3 13.9,14.1 16.6,11.4 19.6,11.4 21.6,13.4 28.6,13.4 29.3,14.1 29.3,30
PIO0_1  (via drill 0.3)
  Top 0.203: v17.8,7.75 17.2,7.15 U1.4
  Bottom 0.203: CON8.7 37.42,17 31.6,17 30.5,15.9 30.5,13.1 27.1,9.7 27.1,8.7 26.6,8.2 25.4,8.2 24.9,8.7 24.9,12.3 24.2,13 21.8,13 20.4,11.6 20.4,9 19.15,7.75 v17.8,7.75
PIO0_11
  Top 0.203: U1.32 26.45,6.65 27.5,7.7 LED1.C
PIO1_2  (via drill 0.3)
  Top 0.203: v34.7,14.8 34.7,14.4 32.4,12.1 v30.3,12.1 | U1.35 26.05,8.15 v26.6,7.6
  Bottom 0.203: U8.7 v34.7,14.8 | v26.6,7.6 26.7,7.6 27.5,8.4 27.5,9.5 30.1,12.1 v30.3,12.1
PIO1_4  (via drill 0.3)
  Top 0.203: v21.46,9.05 U1.40
  Bottom 0.203: v21.46,9.05 21.91,9.5 CON7.2
PIO1_5  (via drill 0.3)
  Top 0.203: v18.96,9.05 U1.45
  Bottom 0.203: v18.96,9.05 13.95,14.06 R12.1
PIO1_6
  Top 0.203: U1.46 18.46,10.66 18.7,10.9 19.1,10.9 19.5,11.3 21.2,11.3 21.6,11.7 23.4,11.7 23.9,12.2 26.9,12.2 28.5,13.8 LED2.C
PIO1_7  (via drill 0.3)
  Top 0.203: v15.5,11.7 13.4,13.8 10.3,13.8 9.9,14.2 9.9,19.93 v10.1,20.12 | v17.96,9.05 U1.47
  Bottom 0.203: U7.6 9.4,20.82 v10.1,20.12 | v15.5,11.7 17.96,9.24 v17.96,9.05
PIO1_9  (via drill 0.3)
  Top 0.2: v35.5,16.2 35.5,6.3 v32.89,3.69
  Top 0.203: U1.17 v19.46,0.8 | v28.2,0.6 28.9,1.3 v29.2,1.3
  Bottom 0.2: U8.8 35.5,15.6 v35.5,16.2 | 26.9,0.4 19.86,0.4 v19.46,0.8
  Bottom 0.203: v28.2,0.6 28,0.4 26.9,0.4 | v19.46,0.8 19.66,0.6 | v32.89,3.69 32.89,1.99 32.2,1.3 v29.2,1.3
PIO2_0  (via drill 0.3)
  Top 0.2: 12.7,12.9 8.9,12.9 8.4,13.4 U2.5
  Top 0.203: v15.2,9.6 15.2,8.4 15.45,8.15 U1.2 | 12.7,12.9 v13.9,11.7
  Bottom 0.203: v15.2,9.6 15.2,10.4 v13.9,11.7
PIO2_5  (via drill 0.3)
  Top 0.203: 20.96,1.34 U1.20 20.96,1.14 21.72,0.38 27.09,0.38 v28.6,1.89
  Bottom 0.203: U6.12 32.31,4.4 32.31,2.2 32,1.89 v28.6,1.89
PIO2_6  (via drill 0.3)
  Top 0.203: R9.1 7.85,14.65 9.1,13.4 13,13.4 v14.7,11.7 | v16.06,9.6 U1.1
  Bottom 0.203: v16.06,9.6 16.06,10.34 v14.7,11.7
PIO2_8  (via drill 0.3)
  Top 0.2: U1.12 v16.06,2 | U2.4 6.3,12.9 8.9,10.3 8.9,8.8 9.4,8.3 9.4,7.3 9.7,7 v9.7,3
  Bottom 0.2: v16.06,2 10.7,2 v9.7,3
PIO2_9  (via drill 0.3)
  Top 0.203: U1.24 22.96,1.6 v23.6,1.6
  Bottom 0.203: v23.6,1.6 22.52,1.6 CON7.9
PIO2_10  (via drill 0.3)
  Top 0.203: v27.2,5.6 27.2,3.8 26.56,3.16 U1.25
  Bottom 0.203: U6.22 v27.2,5.6
PIO3_3
  Top 0.203: U1.48 17.46,10.66 18.1,11.3 18.9,11.3 19.3,11.7 21,11.7 21.4,12.1 23.21,12.1 23.7,12.59 26,12.59 27.1,13.69 LED3.C 27.1,13.8
PIO3_4  (via drill 0.3)
  Top 0.203: U3.8 18.8,19.9 19.1,20.2 v20.1,20.2 | v19.5,6.4 19.5,2.8 19.96,2.34 U1.18 | v9.5,9.1 v9.5,11.6
  Bottom 0.2: 25.1,20.7 25.8,20.7 26.7,21.6 26.7,28 25.45,29.25 25.4,29.3 24.9,29.3
  Bottom 0.203: v20.1,20.2 20.6,20.7 25.1,20.7 | v19.5,6.4 19,5.9 12.7,5.9 v9.5,9.1 | 25.45,29.25 25.45,29.3 6.9,29.3 6.9,26.9 5.8,25.8 5.8,18.1 6.1,17.8 7.44,17.8 R4.1 9.5,15.49 v9.5,11.6
RESET  (via drill 0.3)
  Top 0.203: U1.3 16.9,7.65 v17,7.75
  Bottom 0.203: CON8.6 32,18 30.1,16.1 30.1,13.3 26.7,9.9 26.7,8.9 26.4,8.6 25.6,8.6 25.3,8.9 25.3,12.5 24.4,13.4 21.6,13.4 20,11.8 20,9.2 19.2,8.4 17.65,8.4 v17,7.75
RXD0
  Top 0.2: CON8.5 36.8,18.36 36.8,6.8 33,3
  Top 0.203: 33,3 31.7,3 31.05,3.65 CON5.3 31.05,7.65 29.5,9.2 29.5,10.6 29.2,10.9 27,10.9 26.14,10.04 U1.37
RXD1
  Top 0.203: CON6.3 10.5,5.55 10.5,2.8 10.1,2.4 8.6,2.4 8.2,2.8 8.2,8.3 8.1,8.4 8.1,9.9 7.6,10.4 U2.20
SCK0  (via drill 0.3)
  Top 0.203: JP1.2 v5.75,5.5 | v21,2.8 21.6,2.8 21.96,2.44 U1.22 21.96,1.14 22.36,0.74 26.8,0.74 28,1.94 v28,2.4
  Bottom 0.2: 10.5,3.6 8.9,3.6 7,5.5
  Bottom 0.203: 27.3,6.6 26.6,5.9 26.6,5.3 28,3.9 v28,2.4 | 27.3,6.6 27.9,7.2 27.9,9.1 28.4,9.6 34.1,9.6 34.7,10.2 U8.14 | 27.3,6.6 27.9,6 U6.23 | 10.5,3.6 16,3.6 16.8,2.8 v21,2.8 | v5.75,5.5 7,5.5
SCK1  (via drill 0.3)
  Top 0.203: U1.13 v17.46,4.3
  Bottom 0.203: CON7.5 21.4,6.2 19.5,4.3 v17.46,4.3
SCK_2313  (via drill 0.3)
  Top 0.203: U2.17 v3.4,8.9 3.76,8.54 5.75,8.54 JP1.1
  Bottom 0.203: v3.4,8.9 3.8,8.5 5.8,8.5 6.4,9.1 6.4,11.4 5.4,12.4 5.4,14.96 CON9.5
SCL  (via drill 0.3)
  Top 0.203: v18.25,6.5 18.25,2.55 18.46,2.34 U1.15
  Bottom 0.203: v18.25,6.5 13.6,6.5 12.3,7.8 12.3,17.2 11.1,18.4 R15.2 10.1,18.6 7.12,18.6 U7.8
SDA  (via drill 0.3)
  Top 0.203: U1.16 18.96,2.34 18.85,2.45 v18.85,7.1
  Bottom 0.203: v18.85,7.1 13.9,7.1 12.8,8.2 12.8,17.4 10.75,19.45 R16.2 8.88,19.57 U7.7
SWCLK  (via drill 0.3)
  Top 0.203: U1.29 23.35,5.15 23.1,5.4 23.1,8.8 23.7,9.4 v26,9.4
  Bottom 0.203: CON8.3 30.7,21.8 29.7,20.8 29.7,13.5 26,9.8 v26,9.4
SWDIO  (via drill 0.3)
  Top 0.203: v25.9,10.6 23.6,10.6 23.3,10.9 22.2,10.9 21.96,10.66 U1.39
  Bottom 0.203: CON8.2 30.88,23.07 29.3,21.5 29.3,14 v25.9,10.6
TXD0
  Top 0.2: CON8.4 38.6,19.64 38.6,8 33.2,2.6
  Top 0.203: U1.36 26.45,8.65 26.9,9.1 28.2,9.1 29.55,7.75 CON5.2 29.55,4.25 31.2,2.6 33.2,2.6
TXD1
  Top 0.203: CON6.2 8.95,8.15 8.5,8.6 8.5,10.1 7.2,11.4 U2.1
VCC  (via drill 0.3, 0.8)
  Top 0.2: U5.1 24.77,16.52 v25.1,16.2 | 19.15,21.65 U3.10 19.15,20.9 19.15,21.1 18.65,21.1 18.85,21.3 19.15,21.3 19.15,21.45 19.05,21.45 | 18.1,18.9 U3.6 | U3.6 20.35,18.9 20.35,18.7 | 20.35,18.7 18.55,18.7 | 18.55,18.7 18.55,18.5 20.35,18.5 20.35,18.3 18.55,18.3 18.55,18.1 20.35,18.1 | 20.35,18.1 20.35,17.45 20.05,17.45 | 20.35,18.7 20.35,18.1 | 18.55,18.7 18.55,18.9 U3.6 | 24,23.8 23.6,23.8 23.6,23 24,23 U4.5 24,23.8
  Top 0.203: U3.10 18.7,20.9 19.1,21.3 19.15,21.3 19.65,21.3 C2.1 | C3.1 21.15,21.25 | 23.6,23.4 U4.5 | U4.6 23.6,20.4 | 22.4,21.25 22.4,20.4 U4.6 | U4.6 U4.7 U4.8 | 19.85,18.7 19.65,18.9 U3.6 18.5,18.9 18.95,18.45 | 17.88,16.02 L3.P$1 | 18.95,16.07 19,16.02 v19.52,15.5 | 19.18,17.82 arc90 C6.1
  Top 0.4: U5.6 20,17.82 | 19,16.02 17.88,16.02
  Top 0.6: 19.85,18.7 22.4,21.25
  Top 1: C2.1 C3.1 | 21.15,21.25 22.4,21.25 22.4,23.4 | 22.4,23.4 23.6,23.4 | 18.95,18.45 C6.1 18.95,16.07 | 20,17.82 19.18,17.82 | v21.4,24.7 22.4,23.7 22.4,23.4
  Bottom 0.2: v25.1,16.2 24.1,15.2
  Bottom 0.203: v19.52,15.5 19.56,15.5 19.86,15.2 24.1,15.2 | CON2.2 17.75,24.7 18.1,24.7 | v25.1,16.2 v25.11,16.21 R6.2
  Bottom 1: 18.1,24.7 v21.4,24.7

### Text on the board
tPlace: Z | Y | X
bPlace: Produced by | CREATE 2015